# Altium schematic sheet Э4_2.SchDoc
size 420 x 297 mm; DocumentNumber: ЭАЕСН.464512.002Э4; SheetNumber: 2; SheetTotal: 2
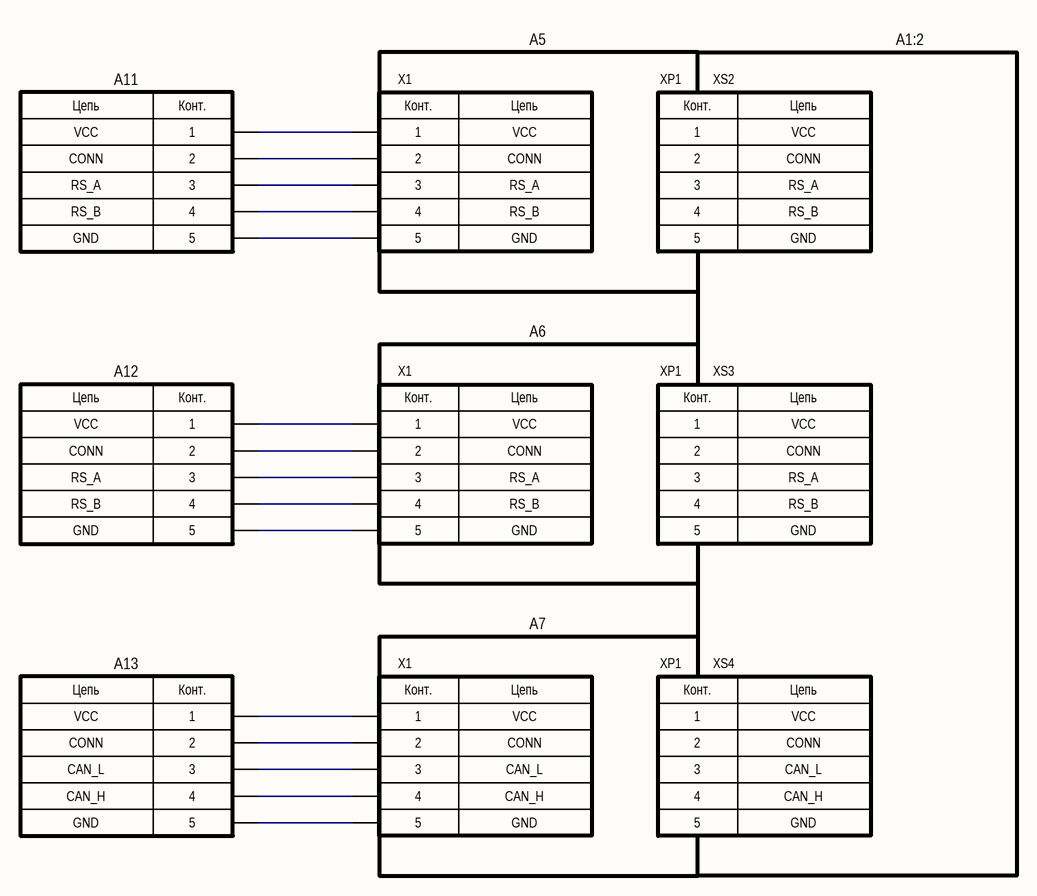
[diagram p0: Э4_2.SchDoc]

## Parts
X1  5pin  (value not drawn)
X2  5pin  (value not drawn)
X3  5pin_con  (value not drawn)
X7  5pin  (value not drawn)
X8  5pin  (value not drawn)
X9  5pin_con  (value not drawn)
X13  5pin  (value not drawn)
X14  5pin  (value not drawn)
X15  5pin_con  (value not drawn)

## Nets
NetX1_1: X1.1 X2.1
NetX1_2: X1.2 X2.2
NetX1_3: X1.3 X2.3
NetX1_4: X1.4 X2.4
NetX1_4: X1.4 X2.4  [a separate net that carries the same name]
NetX7_1: X7.1 X8.1
NetX7_2: X7.2 X8.2
NetX7_3: X7.3 X8.3
NetX7_4: X7.4 X8.4
NetX7_4: X7.4 X8.4  [a separate net that carries the same name]
NetX13_1: X13.1 X14.1
NetX13_2: X13.2 X14.2
NetX13_3: X13.3 X14.3
NetX13_4: X13.4 X14.4
NetX13_4: X13.4 X14.4  [a separate net that carries the same name]

## Notes on the sheet
- A5
- A1:2
- VCC
- A11
- (near X1) X1
- (near X3) XP1
- XS2
- CONN
- RS_A
- RS_B
- GND
- A6
- A12
- (near X7) X1
- (near X9) XP1
- XS3
- A13
- (near X13) X1
- A7
- (near X15) XP1
- XS4
- CAN_L
- CAN_H
- Подп. и дата
- Инв.№ дубл.
- Взам. инв. №
- Инв № подл.
- Изм.
- Лист
- № докум.
- Подп.
- Дата
- Копировал
- Формат А3
- (in symbol 5pin) Конт.; Цепь; 5
- (in symbol 5pin_con) Конт.; Цепь; 1; 2; 3; 4; 5